# EasyEDA Pro project InkTime_JLC_EDA.epro

# Board PCB1
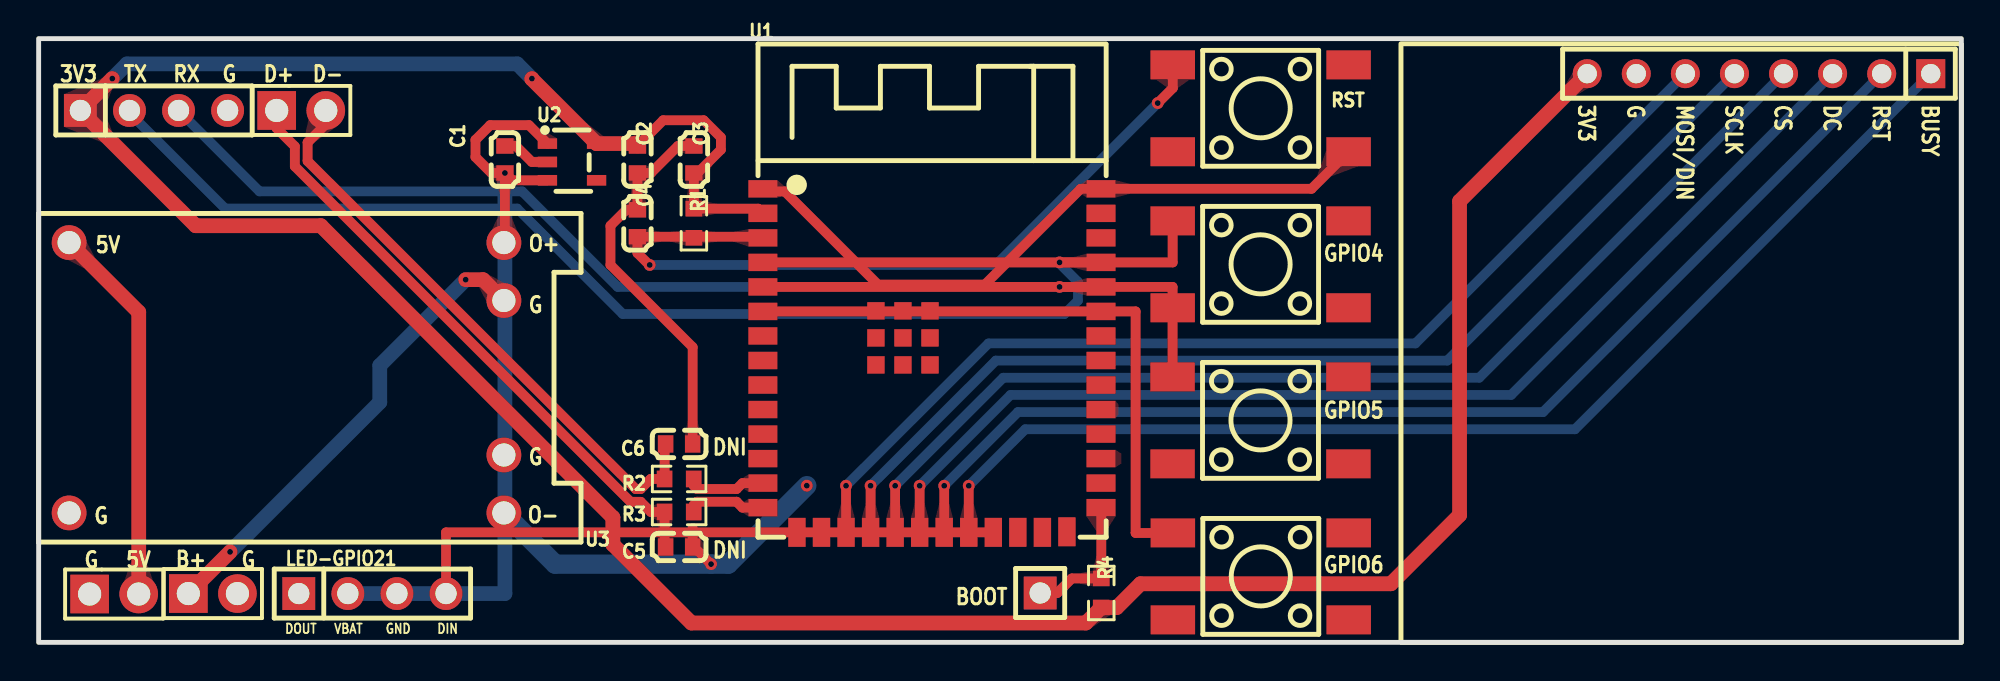
[diagram p0: board, top side]
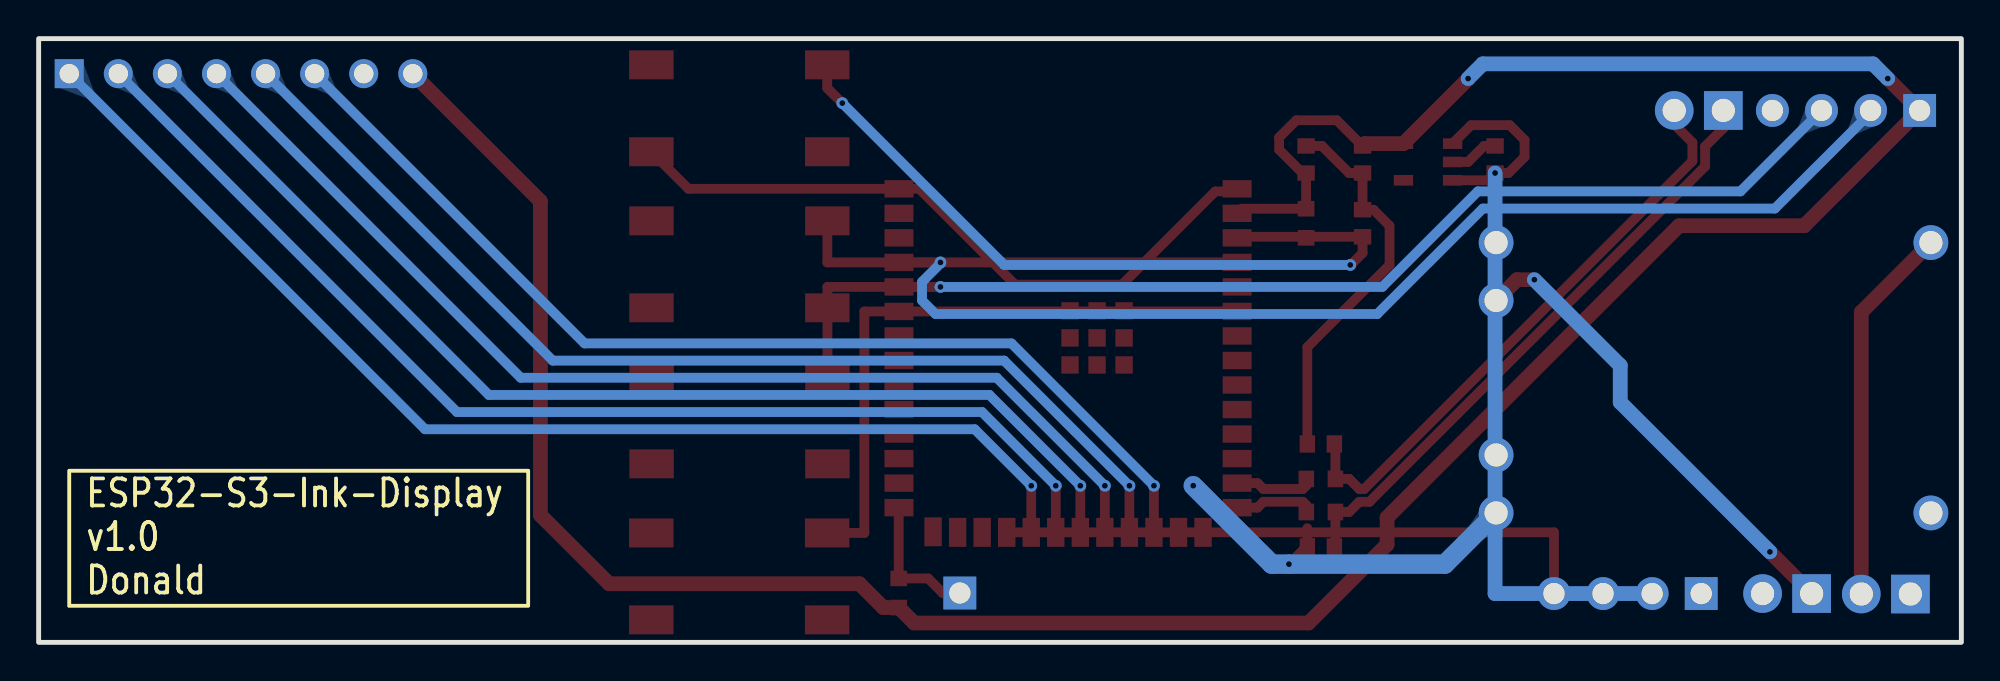
[diagram p1: board, bottom side, seen from below]

Outline 99.5 x 31.27 mm; copper layers: Top Layer, Bottom Layer. Coordinates in mm from the lower left corner of the outline.
Outline path: rectangle 0,31.27 99.5,0
Stack: Top Layer 0.035mm / Dielectric1 1.51mm FR4 er 4.5 / Bottom Layer 0.035mm

## Design rules (mm)
net $1N1349: DP1
net $1N1352: DP1
net $1N1543: DP2
net $1N1537: DP2
template: 自定义配置
spacing copperThickness1oz (default): track to track 0.102, other pairs 0.152 to 0.3
spacing copperThickness2oz: track to track 0.203, other pairs 0.152 to 0.3
track width copperThickness1oz (default): min 0.127, default 0.254, max 2.54
track width copperThickness2oz: min 0.203, default 0.254, max 2.54
differential pair differentialPair (default): width min 0.127, default 0.254, max 2.54; gap min 0.152, default 0.152
via viaSize (default): diameter min 0.5, default 0.61, max 10; hole min 0.3, default 0.305, max 6.3

## Placement (name value [footprint] x y rotation side)
C1  4.7uF  [C0603]  24.13 25.01 270 top
C2  10uF  [C0603]  30.99 25.01 90 top
C3  100nF  [C0603]  33.91 25.01 90 top
C4  1uF  [C0603]  30.99 21.7 270 top
C5  47pF  [C0603]  33.15 4.94 180 top
C6  47pF  [C0603]  33.15 10.28 180 top
H1  PZ254V-11-04P  [HDR-TH_4P-P2.54-V-M]  5.97 27.55 0 top
H2  PZ254V-11-02P  [HDR-TH_2P-P2.54-V-M]  13.59 27.55 0 top
H3  PZ254V-11-01P  [HDR-TH_1P-P2.54-V-M]  51.83 2.56 0 top
H4  HC-PZ254-11.5L-1x8PZ  [HDR-TH_8P-P2.54-V-M]  89.03 29.45 180 top
H5  PZ254V-11-02P  [HDR-TH_2P-P2.54-V-M]  9.02 2.53 0 top
H6  PZ254V-11-02P  [HDR-TH_2P-P2.54-V-M]  3.91 2.5 0 top
H7  PZ254V-11-04P  [HDR-TH_4P-P2.54-V-M]  17.27 2.53 0 top
R1  10kΩ  [R0603]  33.91 21.7 90 top
R2  22Ω  [R0603]  33.15 8.46 0 top
R3  22Ω  [R0603]  33.15 6.75 0 top
R4  10kΩ  [R0603]  54.99 2.56 270 top
RST  KH-6X6X5H-STM  [SW-SMD_4P-L6.0-W6.0-P4.50-LS9.0_H5.0]  63.24 27.66 180 top
SW2  KH-6X6X5H-STM  [SW-SMD_4P-L6.0-W6.0-P4.50-LS9.0_H5.0]  63.24 19.58 0 top
SW3  KH-6X6X5H-STM  [SW-SMD_4P-L6.0-W6.0-P4.50-LS9.0_H5.0]  63.23 11.5 0 top
SW4  KH-6X6X5H-STM  [SW-SMD_4P-L6.0-W6.0-P4.50-LS9.0_H5.0]  63.25 3.42 0 top
U1  ESP32-S3-WROOM-1-N8R8  [WIRELM-SMD_ESP32-S3-WROOM-1]  46.23 14.59 0 top
U2  MIC5219-3.3YM5-TR  [SOT-23-5_L3.0-W1.7-P0.95-LS2.8-TL]  27.6 24.88 0 top
U3  -  [PWRM-TH_TP4056]  12.83 13.7 180 top

## Footprints (pads in the part's own frame, mm; a bottom-side part is the same pattern mirrored in y, then rotated)
C0603
  rect 0.8x0.9 smd: 1(-0.7,0) 2(0.7,0)
HDR-TH_1P-P2.54-V-M
  rect 1.7x1.7 hole 1.1: 1(0,0)
HDR-TH_2P-P2.54-V-M
  rect 2x2 hole 1.2: 1(-1.27,0)
  round 2 hole 1.2: 2(1.27,0)
HDR-TH_4P-P2.54-V-M
  rect 1.7x1.7 hole 1.1: 1(-3.81,0)
  round 1.7 hole 1.1: 2(-1.27,0) 3(1.27,0) 4(3.81,0)
HDR-TH_8P-P2.54-V-M
  rect 1.5x1.5 hole 1: 1(-8.89,0)
  round 1.5 hole 1: 2(-6.35,0) 3(-3.81,0) 4(-1.27,0) 5(1.27,0) 6(3.81,0) 7(6.35,0) 8(8.89,0)
PWRM-TH_TP4056
  round 1.8 hole 1.2: 1(11.25,7) 2(-11.25,7) 3(-11.25,4) 4(-11.25,-4) 5(11.25,-7) 6(-11.25,-7)
R0603
  rect 0.806x0.864 smd: 1(-0.753,0) 2(0.753,0)
SOT-23-5_L3.0-W1.7-P0.95-LS2.8-TL
  rect 1x0.55 smd: 1(-1.272,0.95) 2(-1.272,0) 3(-1.272,-0.95) 4(1.272,-0.95) 5(1.272,0.95)
SW-SMD_4P-L6.0-W6.0-P4.50-LS9.0_H5.0
  rect 2.3x1.5 smd: 1(-4.55,2.25) 2(4.55,2.25) 3(-4.55,-2.25) 4(4.55,-2.25)
WIRELM-SMD_ESP32-S3-WROOM-1
  rect 1.5x0.9 smd: 1(-8.75,8.895) 2(-8.75,7.625) 3(-8.75,6.355) 4(-8.75,5.085) 5(-8.75,3.815) 6(-8.75,2.545) 7(-8.75,1.275) 8(-8.75,0.005) 9(-8.75,-1.265) 10(-8.75,-2.535) 11(-8.75,-3.805) 12(-8.75,-5.075) 13(-8.75,-6.345) 14(-8.75,-7.615) 27(8.75,-7.615) 28(8.75,-6.345) 29(8.75,-5.075) 30(8.75,-3.805) 31(8.75,-2.535) 32(8.75,-1.265) 33(8.75,0.005) 34(8.75,1.275) 35(8.75,2.545) 36(8.75,3.815) 37(8.75,5.085) 38(8.75,6.355) 39(8.75,7.625) 40(8.75,8.895)
  rect 0.9x1.5 smd: 15(-6.985,-8.895) 16(-5.715,-8.895) 17(-4.445,-8.895) 18(-3.175,-8.895) 19(-1.905,-8.895) 20(-0.635,-8.895) 21(0.635,-8.895) 22(1.905,-8.895) 23(3.175,-8.895) 24(4.445,-8.895) 25(5.715,-8.895) 26(6.985,-8.865)
  rect 0.9x0.9 smd: 41(-2.9,2.575) 41(-2.9,1.175) 41(-2.9,-0.225) 41(-1.5,2.575) 41(-1.5,1.175) 41(-1.5,-0.225) 41(-0.1,2.575) 41(-0.1,1.175) 41(-0.1,-0.225)

## Nets
3V3: C2.2 C3.1 H1.1 H4.8 R1.2 R4.2 U1.2 U2.5
GND: C1.1 C2.1 C3.2 C4.1 C5.1 C6.1 H1.4 H4.7 H5.2 H6.1 H7.3 RST.1 SW2.4 SW3.4 SW4.4 U1.1 U1.40 U2.2 U3.1 U3.2 U3.3
VBAT: C1.2 H7.2 U2.1 U2.3 U3.6
$1N1349: R2.2 U1.13
$1N1352: R3.2 U1.14
$1N1537: C5.2 H2.1 R3.1
$1N1543: C6.2 H2.2 R2.1
$1N2012: C4.2 R1.1 RST.4 U1.3
$1N3065: H1.3 U1.36
$1N3068: H1.2 U1.37
$1N3364: SW2.1 U1.4
$1N3369: SW3.1 U1.5
$1N3373: SW4.1 U1.6
$1N3551: H3.1 R4.1 U1.27
$1N3676: H4.6 U1.17
$1N3679: H4.5 U1.18
$1N3682: H4.4 U1.19
$1N3685: H4.3 U1.20
$1N3688: H4.2 U1.21
$1N3691: H4.1 U1.22
$1N3760: H5.1 U3.4
$1N3811: H6.2 U3.5
$1N5490: H7.4 U1.23

Pads without a net: H7 1; RST 2 3; SW2 2 3; SW3 2 3; SW4 2 3; U1 7 8 9 10 11 12 15 16 24 25 26 28 29 30 31 32 33 34 35 38 39 41; U2 4

## Via types
v1: diameter 0.61, hole 0.305, Top Layer to Bottom Layer, 17 vias

## Routing (per net, layer and track width the routed paths; a pad name or vN(x,y) marks a point on that pad's centre or on a via; arc(x,y) is an arc through that point)
3V3: length 156
  Top Layer w0.504: C2.2 32.32,27.04 34.42,27.04 35.31,26.15 35.31,25.52 34.1,24.31 C3.1
  Top Layer w0.508: C3.1 R1.2 37.24,22.46 U1.2
  Top Layer w0.762: v1(3.81,29.2) 2.16,27.55 8.13,21.58 14.61,21.58 29.72,6.47 29.72,5.07 33.78,1 54.19,1 R4.2 55.79,1.8 57.02,3.04 69.98,3.04 73.53,6.59 73.53,22.85 H4.8 ; v1(25.53,29.2) 25.53,29.17 U2.5 30.87,25.83 C2.2
  Bottom Layer w0.762: v1(25.53,29.2) 24.77,29.96 4.57,29.96 v1(3.81,29.2)
GND: length 78.7
  Top Layer w0.504: RST.1 65.87,23.49 U1.40 53.93,23.49 48.97,18.53 43.43,18.53 38.61,23.36 37.61,23.36 U1.1 ; 33.85,5.92 C5.1 33.91,4.94 v1(34.8,4.05) ; C4.1 30.42,22.41 29.59,21.58 29.59,19.55 33.85,15.29 C6.1
  Top Layer w0.508: C3.2 33.09,25.71 31.69,24.31 C2.1 C4.1 ; U2.2 25.53,24.88 24.7,25.71 C1.1
  Bottom Layer w1: v1(39.75,8.12) 35.69,4.05 v1(34.8,4.05) 26.73,4.05 U3.2
VBAT: length 43.1
  Top Layer w0.508: U2.3 24.51,23.93 v1(24.13,24.31) ; v1(24.13,24.31) 23.43,24.31 22.61,25.13 22.61,26.02 23.37,26.78 25.37,26.78 U2.1 ; v1(24.13,24.31) 24.13,20.76 U3.6
  Bottom Layer w0.762: H7.2 24.13,2.53 v1(24.13,24.31)
$1N1349: length 4.1
  Top Layer w0.508: U1.13 36.42,8.25 36.12,7.94 34.08,7.94 33.9,8.12 R2.2
$1N1352: length 4.1
  Top Layer w0.508: R3.2 33.9,7.1 34.08,7.28 36.12,7.28 36.42,6.98 U1.14
$1N1537: length 31.7
  Top Layer w0.508: C5.2 32.39,4.99 R3.1 31.68,6.75 31.16,7.28 30.63,7.28 13.26,24.65 13.26,25.68 12.32,26.62 H2.1
$1N1543: length 30.6
  Top Layer w0.508: H2.2 14.86,26.83 13.92,25.89 13.92,24.92 30.91,7.94 31.15,7.94 31.67,8.46 R2.1 32.39,10.22 C6.2
$1N2012: length 40.3
  Top Layer w0.254: 37.42,21 U1.3
  Top Layer w0.508: 58.69,29.91 58.69,28.71 v1(57.91,27.93) ; v1(31.62,19.55) 31.6,19.55 30.99,20.16 C4.2 37.42,21
  Bottom Layer w0.508: v1(57.91,27.93) 49.53,19.55 v1(31.62,19.55)
$1N3065: length 51.5
  Top Layer w0.504: U1.36 v1(52.83,18.41)
  Bottom Layer w0.504: 7.24,27.55 11.43,23.36 25.02,23.36 29.97,18.41 v1(52.83,18.41)
$1N3068: length 58.3
  Top Layer w0.504: U1.37 v1(52.83,19.68)
  Bottom Layer w0.504: v1(52.83,19.68) 52.83,19.62 53.78,18.67 53.78,17.7 53.09,17.01 30.23,17.01 24.77,22.47 9.65,22.47 4.7,27.42 H1.2
$1N3364: length 23.4
  Top Layer w0.508: SW2.1 58.69,19.68 U1.4
$1N3369: length 25.9
  Top Layer w0.508: U1.5 58.68,18.41 SW3.1
$1N3373: length 32.7
  Top Layer w0.508: SW4.1 56.77,5.67 56.77,17.14 U1.6
$1N3551: length 7.1
  Top Layer w0.508: H3.1 52.71,2.56 53.47,3.31 R4.1 54.99,6.97 U1.27
$1N3676: length 54.7
  Top Layer w0.504: v1(41.78,8.11) U1.17
  Bottom Layer w0.504: H4.6 71.25,15.48 49.15,15.48 v1(41.78,8.11)
$1N3679: length 56
  Top Layer w0.504: v1(43.05,8.11) U1.18
  Bottom Layer w0.504: H4.5 72.9,14.59 49.53,14.59 v1(43.05,8.11)
$1N3682: length 57.2
  Top Layer w0.504: v1(44.32,8.11) U1.19
  Bottom Layer w0.504: v1(44.32,8.11) 49.92,13.7 74.55,13.7 H4.4
$1N3685: length 58.5
  Top Layer w0.504: v1(45.59,8.11) 45.59,5.7
  Bottom Layer w0.504: v1(45.59,8.11) 50.3,12.81 76.2,12.81 H4.3
$1N3688: length 59.8
  Top Layer w0.504: v1(46.86,8.11) U1.21
  Bottom Layer w0.504: v1(46.86,8.11) 50.68,11.93 77.85,11.93 H4.2
$1N3691: length 61
  Top Layer w0.504: v1(48.13,8.11) U1.22
  Bottom Layer w0.504: v1(48.13,8.11) 51.06,11.04 79.5,11.04 H4.1
$1N3760: length 24.6
  Top Layer w0.762: U3.4 23,18.78 v1(22.1,18.78) ; H5.1 v1(9.91,4.69)
  Bottom Layer w0.762: v1(9.91,4.69) 17.65,12.43 17.65,14.34 v1(22.1,18.78)
$1N3811: length 19.7
  Top Layer w0.762: U3.5 5.18,17.1 H6.2
$1N5490: length 31.5
  Top Layer w0.504: H7.4 21.08,5.7 U1.23

## Copper pours and planes (outline as drawn; the poured copper is in the pictures)
GND on Top Layer: -2.67,34.66 102.36,34.66 102.36,-2.42 -2.67,-2.42

Small or netless copper shapes (teardrops, artwork), in the pictures only: 59 on Top Layer, 9 on Bottom Layer

## Text on the board
Bottom Silkscreen Layer: ESP32-S3-Ink-Display / v1.0 / Donald
Top Silkscreen Layer: DOUT | VBAT | GND | DIN | LED-GPIO21 | 3V3 | G | 5V | TX | RX | B+ | D+ | D- | O- | O+ | BOOT | GPIO4 | GPIO5 | GPIO6 | MOSI/DIN | SCLK | CS | DC | RST | BUSY | DNI
